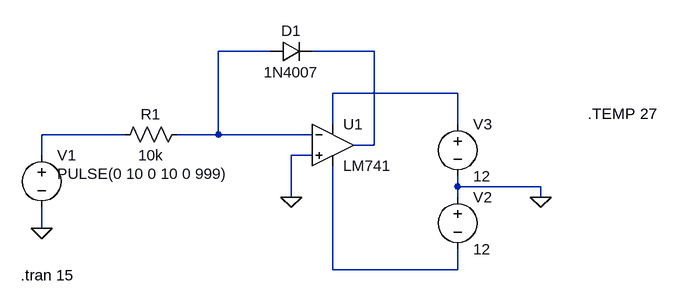
[diagram p0: schematic LogDiode.asc]
LogDiode.asc, the LTspice schematic file:
Version 4
SHEET 1 880 680
WIRE 96 -176 16 -176
WIRE 256 -176 160 -176
WIRE 384 -112 192 -112
WIRE 192 -64 192 -112
WIRE 384 -64 384 -112
WIRE -128 -48 -256 -48
WIRE 16 -48 16 -176
WIRE 16 -48 -48 -48
WIRE 160 -48 16 -48
WIRE 256 -32 256 -176
WIRE 256 -32 224 -32
WIRE -256 -16 -256 -48
WIRE 160 -16 128 -16
WIRE 384 32 384 16
WIRE 512 32 384 32
WIRE 128 48 128 -16
WIRE 384 48 384 32
WIRE 512 48 512 32
WIRE -256 96 -256 64
WIRE 192 160 192 0
WIRE 384 160 384 128
WIRE 384 160 192 160
FLAG -256 96 0
FLAG 512 48 0
FLAG 128 48 0
SYMBOL voltage -256 -32 R0
WINDOW 3 24 44 Left 2
WINDOW 123 0 0 Left 0
WINDOW 39 0 0 Left 0
SYMATTR Value PULSE(0 10 0 10 0 999)
SYMATTR InstName V1
SYMBOL voltage 384 32 R0
WINDOW 123 0 0 Left 0
WINDOW 39 0 0 Left 0
SYMATTR InstName V2
SYMATTR Value 12
SYMBOL voltage 384 -80 R0
WINDOW 123 0 0 Left 0
WINDOW 39 0 0 Left 0
SYMATTR InstName V3
SYMATTR Value 12
SYMBOL OpAmps\\LM741 192 -96 R0
SYMATTR InstName U1
SYMBOL res -32 -64 R90
WINDOW 0 0 56 VBottom 2
WINDOW 3 32 56 VTop 2
SYMATTR InstName R1
SYMATTR Value 10k
SYMBOL diode 96 -160 R270
WINDOW 0 32 32 VTop 2
WINDOW 3 0 32 VBottom 2
SYMATTR InstName D1
SYMATTR Value 1N4007
TEXT -288 168 Left 2 !.tran 15
TEXT 584 -80 Left 2 !.TEMP 27

The netlist it stands for:
* LogDiode.asc
V1 N004 0 PULSE(0 10 0 10 0 999)
V2 0 N005 12
V3 N003 0 12
XU1 0 N001 N003 N005 N002 LM741  ; pins In+ In- V+ V- OUT
R1 N001 N004 10k
D1 N001 N002 1N4007
.model D D
.lib standard.dio
.tran 15
.TEMP 27
.lib LM741.lib
.backanno
.end